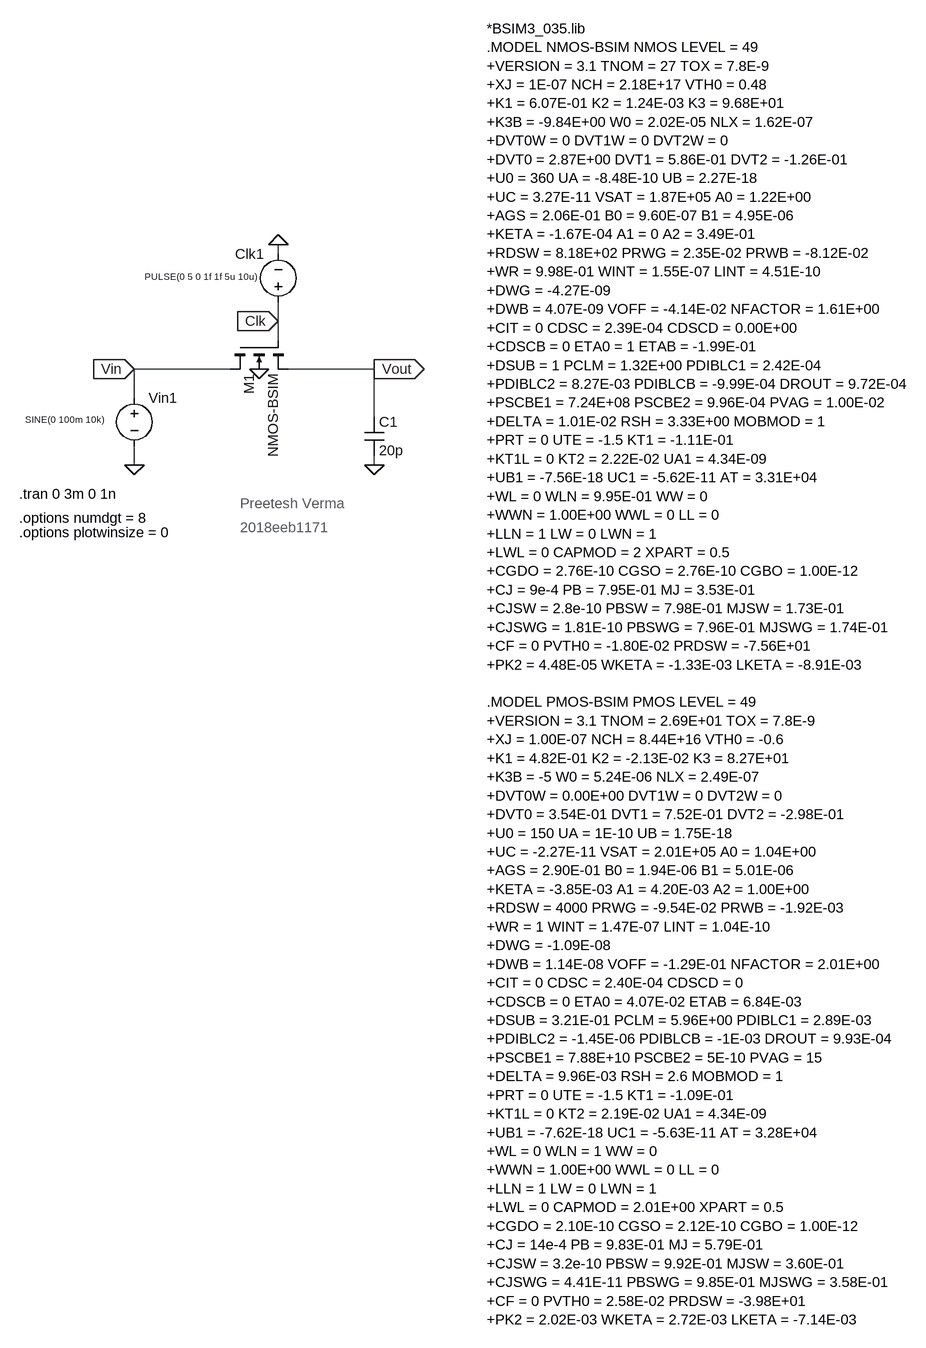
[diagram p0: schematic SH_using_NMOS_Sine.asc]
SH_using_NMOS_Sine.asc, the LTspice schematic file:
Version 4
SHEET 1 3080 1268
WIRE -240 -304 -240 -320
WIRE -240 -192 -240 -224
WIRE -240 -160 -240 -192
WIRE -320 -112 -480 -112
WIRE -80 -112 -224 -112
WIRE -480 -64 -480 -112
WIRE -80 -32 -80 -112
WIRE -480 48 -480 16
WIRE -80 48 -80 32
FLAG -480 48 0
FLAG -272 -112 0
FLAG -80 48 0
FLAG -240 -320 0
FLAG -480 -112 Vin
IOPIN -480 -112 In
FLAG -80 -112 Vout
IOPIN -80 -112 Out
FLAG -240 -192 Clk
IOPIN -240 -192 In
SYMBOL nmos4 -320 -160 M90
SYMATTR InstName M1
SYMATTR Value NMOS-BSIM
SYMATTR Value2 l=0.2u w=12u
SYMBOL voltage -480 -80 R0
WINDOW 3 -182 52 Left 1
WINDOW 123 0 0 Left 0
WINDOW 39 0 0 Left 0
SYMATTR Value SINE(0 100m 10k)
SYMATTR InstName Vin1
SYMBOL cap -96 -32 R0
SYMATTR InstName C1
SYMATTR Value 20p
SYMBOL voltage -240 -208 R180
WINDOW 0 24 96 Left 2
WINDOW 3 34 58 Left 1
WINDOW 123 0 0 Left 0
WINDOW 39 0 0 Left 0
SYMATTR InstName Clk1
SYMATTR Value PULSE(0 5 0 1f 1f 5u 10u)
TEXT -672 96 Left 2 !.tran 0 3m 0 1n
TEXT 2336 -680 Left 2 !*BSIM3_035.lib\n.MODEL NMOS-BSIM NMOS LEVEL = 49\n+VERSION = 3.1 TNOM = 27 TOX = 7.8E-9\n+XJ = 1E-07 NCH = 2.18E+17 VTH0 = 0.48\n+K1 = 6.07E-01 K2 = 1.24E-03 K3 = 9.68E+01\n+K3B = -9.84E+00 W0 = 2.02E-05 NLX = 1.62E-07\n+DVT0W = 0 DVT1W = 0 DVT2W = 0\n+DVT0 = 2.87E+00 DVT1 = 5.86E-01 DVT2 = -1.26E-01\n+U0 = 360 UA = -8.48E-10 UB = 2.27E-18\n+UC = 3.27E-11 VSAT = 1.87E+05 A0 = 1.22E+00\n+AGS = 2.06E-01 B0 = 9.60E-07 B1 = 4.95E-06\n+KETA = -1.67E-04 A1 = 0 A2 = 3.49E-01\n+RDSW = 8.18E+02 PRWG = 2.35E-02 PRWB = -8.12E-02\n+WR = 9.98E-01 WINT = 1.55E-07 LINT = 4.51E-10\n+DWG = -4.27E-09\n+DWB = 4.07E-09 VOFF = -4.14E-02 NFACTOR = 1.61E+00\n+CIT = 0 CDSC = 2.39E-04 CDSCD = 0.00E+00\n+CDSCB = 0 ETA0 = 1 ETAB = -1.99E-01\n+DSUB = 1 PCLM = 1.32E+00 PDIBLC1 = 2.42E-04\n+PDIBLC2 = 8.27E-03 PDIBLCB = -9.99E-04 DROUT = 9.72E-04\n+PSCBE1 = 7.24E+08 PSCBE2 = 9.96E-04 PVAG = 1.00E-02\n+DELTA = 1.01E-02 RSH = 3.33E+00 MOBMOD = 1\n+PRT = 0 UTE = -1.5 KT1 = -1.11E-01\n+KT1L = 0 KT2 = 2.22E-02 UA1 = 4.34E-09\n+UB1 = -7.56E-18 UC1 = -5.62E-11 AT = 3.31E+04\n+WL = 0 WLN = 9.95E-01 WW = 0\n+WWN = 1.00E+00 WWL = 0 LL = 0\n+LLN = 1 LW = 0 LWN = 1\n+LWL = 0 CAPMOD = 2 XPART = 0.5\n+CGDO = 2.76E-10 CGSO = 2.76E-10 CGBO = 1.00E-12\n+CJ = 9e-4 PB = 7.95E-01 MJ = 3.53E-01\n+CJSW = 2.8e-10 PBSW = 7.98E-01 MJSW = 1.73E-01\n+CJSWG = 1.81E-10 PBSWG = 7.96E-01 MJSWG = 1.74E-01\n+CF = 0 PVTH0 = -1.80E-02 PRDSW = -7.56E+01\n+PK2 = 4.48E-05 WKETA = -1.33E-03 LKETA = -8.91E-03\n \n.MODEL PMOS-BSIM PMOS LEVEL = 49\n+VERSION = 3.1 TNOM = 2.69E+01 TOX = 7.8E-9\n+XJ = 1.00E-07 NCH = 8.44E+16 VTH0 = -0.6\n+K1 = 4.82E-01 K2 = -2.13E-02 K3 = 8.27E+01\n+K3B = -5 W0 = 5.24E-06 NLX = 2.49E-07\n+DVT0W = 0.00E+00 DVT1W = 0 DVT2W = 0\n+DVT0 = 3.54E-01 DVT1 = 7.52E-01 DVT2 = -2.98E-01\n+U0 = 150 UA = 1E-10 UB = 1.75E-18\n+UC = -2.27E-11 VSAT = 2.01E+05 A0 = 1.04E+00\n+AGS = 2.90E-01 B0 = 1.94E-06 B1 = 5.01E-06\n+KETA = -3.85E-03 A1 = 4.20E-03 A2 = 1.00E+00\n+RDSW = 4000 PRWG = -9.54E-02 PRWB = -1.92E-03\n+WR = 1 WINT = 1.47E-07 LINT = 1.04E-10\n+DWG = -1.09E-08\n+DWB = 1.14E-08 VOFF = -1.29E-01 NFACTOR = 2.01E+00\n+CIT = 0 CDSC = 2.40E-04 CDSCD = 0\n+CDSCB = 0 ETA0 = 4.07E-02 ETAB = 6.84E-03\n+DSUB = 3.21E-01 PCLM = 5.96E+00 PDIBLC1 = 2.89E-03\n+PDIBLC2 = -1.45E-06 PDIBLCB = -1E-03 DROUT = 9.93E-04\n+PSCBE1 = 7.88E+10 PSCBE2 = 5E-10 PVAG = 15\n+DELTA = 9.96E-03 RSH = 2.6 MOBMOD = 1\n+PRT = 0 UTE = -1.5 KT1 = -1.09E-01\n+KT1L = 0 KT2 = 2.19E-02 UA1 = 4.34E-09\n+UB1 = -7.62E-18 UC1 = -5.63E-11 AT = 3.28E+04\n+WL = 0 WLN = 1 WW = 0\n+WWN = 1.00E+00 WWL = 0 LL = 0\n+LLN = 1 LW = 0 LWN = 1\n+LWL = 0 CAPMOD = 2.01E+00 XPART = 0.5\n+CGDO = 2.10E-10 CGSO = 2.12E-10 CGBO = 1.00E-12\n+CJ = 14e-4 PB = 9.83E-01 MJ = 5.79E-01\n+CJSW = 3.2e-10 PBSW = 9.92E-01 MJSW = 3.60E-01\n+CJSWG = 4.41E-11 PBSWG = 9.85E-01 MJSWG = 3.58E-01\n+CF = 0 PVTH0 = 2.58E-02 PRDSW = -3.98E+01\n+PK2 = 2.02E-03 WKETA = 2.72E-03 LKETA = -7.14E-03
TEXT -672 136 Left 2 !.options numdgt = 8
TEXT -672 160 Left 2 !.options plotwinsize = 0
TEXT -304 112 Left 2 ;Preetesh Verma
TEXT -304 152 Left 2 ;2018eeb1171

The netlist it stands for:
* SH_using_NMOS_Sine.asc
M1 Vin Clk Vout 0 NMOS-BSIM l=0.2u w=12u
Vin1 Vin 0 SINE(0 100m 10k)
C1 Vout 0 20p
V§Clk1 Clk 0 PULSE(0 5 0 1f 1f 5u 10u)
.model NMOS NMOS
.model PMOS PMOS
.lib standard.mos
.tran 0 3m 0 1n
*BSIM3_035.lib
.MODEL NMOS-BSIM NMOS LEVEL = 49
+VERSION = 3.1 TNOM = 27 TOX = 7.8E-9
+XJ = 1E-07 NCH = 2.18E+17 VTH0 = 0.48
+K1 = 6.07E-01 K2 = 1.24E-03 K3 = 9.68E+01
+K3B = -9.84E+00 W0 = 2.02E-05 NLX = 1.62E-07
+DVT0W = 0 DVT1W = 0 DVT2W = 0
+DVT0 = 2.87E+00 DVT1 = 5.86E-01 DVT2 = -1.26E-01
+U0 = 360 UA = -8.48E-10 UB = 2.27E-18
+UC = 3.27E-11 VSAT = 1.87E+05 A0 = 1.22E+00
+AGS = 2.06E-01 B0 = 9.60E-07 B1 = 4.95E-06
+KETA = -1.67E-04 A1 = 0 A2 = 3.49E-01
+RDSW = 8.18E+02 PRWG = 2.35E-02 PRWB = -8.12E-02
+WR = 9.98E-01 WINT = 1.55E-07 LINT = 4.51E-10
+DWG = -4.27E-09
+DWB = 4.07E-09 VOFF = -4.14E-02 NFACTOR = 1.61E+00
+CIT = 0 CDSC = 2.39E-04 CDSCD = 0.00E+00
+CDSCB = 0 ETA0 = 1 ETAB = -1.99E-01
+DSUB = 1 PCLM = 1.32E+00 PDIBLC1 = 2.42E-04
+PDIBLC2 = 8.27E-03 PDIBLCB = -9.99E-04 DROUT = 9.72E-04
+PSCBE1 = 7.24E+08 PSCBE2 = 9.96E-04 PVAG = 1.00E-02
+DELTA = 1.01E-02 RSH = 3.33E+00 MOBMOD = 1
+PRT = 0 UTE = -1.5 KT1 = -1.11E-01
+KT1L = 0 KT2 = 2.22E-02 UA1 = 4.34E-09
+UB1 = -7.56E-18 UC1 = -5.62E-11 AT = 3.31E+04
+WL = 0 WLN = 9.95E-01 WW = 0
+WWN = 1.00E+00 WWL = 0 LL = 0
+LLN = 1 LW = 0 LWN = 1
+LWL = 0 CAPMOD = 2 XPART = 0.5
+CGDO = 2.76E-10 CGSO = 2.76E-10 CGBO = 1.00E-12
+CJ = 9e-4 PB = 7.95E-01 MJ = 3.53E-01
+CJSW = 2.8e-10 PBSW = 7.98E-01 MJSW = 1.73E-01
+CJSWG = 1.81E-10 PBSWG = 7.96E-01 MJSWG = 1.74E-01
+CF = 0 PVTH0 = -1.80E-02 PRDSW = -7.56E+01
+PK2 = 4.48E-05 WKETA = -1.33E-03 LKETA = -8.91E-03
.MODEL PMOS-BSIM PMOS LEVEL = 49
+VERSION = 3.1 TNOM = 2.69E+01 TOX = 7.8E-9
+XJ = 1.00E-07 NCH = 8.44E+16 VTH0 = -0.6
+K1 = 4.82E-01 K2 = -2.13E-02 K3 = 8.27E+01
+K3B = -5 W0 = 5.24E-06 NLX = 2.49E-07
+DVT0W = 0.00E+00 DVT1W = 0 DVT2W = 0
+DVT0 = 3.54E-01 DVT1 = 7.52E-01 DVT2 = -2.98E-01
+U0 = 150 UA = 1E-10 UB = 1.75E-18
+UC = -2.27E-11 VSAT = 2.01E+05 A0 = 1.04E+00
+AGS = 2.90E-01 B0 = 1.94E-06 B1 = 5.01E-06
+KETA = -3.85E-03 A1 = 4.20E-03 A2 = 1.00E+00
+RDSW = 4000 PRWG = -9.54E-02 PRWB = -1.92E-03
+WR = 1 WINT = 1.47E-07 LINT = 1.04E-10
+DWG = -1.09E-08
+DWB = 1.14E-08 VOFF = -1.29E-01 NFACTOR = 2.01E+00
+CIT = 0 CDSC = 2.40E-04 CDSCD = 0
+CDSCB = 0 ETA0 = 4.07E-02 ETAB = 6.84E-03
+DSUB = 3.21E-01 PCLM = 5.96E+00 PDIBLC1 = 2.89E-03
+PDIBLC2 = -1.45E-06 PDIBLCB = -1E-03 DROUT = 9.93E-04
+PSCBE1 = 7.88E+10 PSCBE2 = 5E-10 PVAG = 15
+DELTA = 9.96E-03 RSH = 2.6 MOBMOD = 1
+PRT = 0 UTE = -1.5 KT1 = -1.09E-01
+KT1L = 0 KT2 = 2.19E-02 UA1 = 4.34E-09
+UB1 = -7.62E-18 UC1 = -5.63E-11 AT = 3.28E+04
+WL = 0 WLN = 1 WW = 0
+WWN = 1.00E+00 WWL = 0 LL = 0
+LLN = 1 LW = 0 LWN = 1
+LWL = 0 CAPMOD = 2.01E+00 XPART = 0.5
+CGDO = 2.10E-10 CGSO = 2.12E-10 CGBO = 1.00E-12
+CJ = 14e-4 PB = 9.83E-01 MJ = 5.79E-01
+CJSW = 3.2e-10 PBSW = 9.92E-01 MJSW = 3.60E-01
+CJSWG = 4.41E-11 PBSWG = 9.85E-01 MJSWG = 3.58E-01
+CF = 0 PVTH0 = 2.58E-02 PRDSW = -3.98E+01
+PK2 = 2.02E-03 WKETA = 2.72E-03 LKETA = -7.14E-03
.options numdgt = 8
.options plotwinsize = 0
* Preetesh Verma
* 2018eeb1171
.backanno
.end